# Altium schematic sheet УШЯИ.467444.130Э3_1-R1.SchDoc
size 420 x 297 mm; SheetNumber: 1; SheetTotal: 5
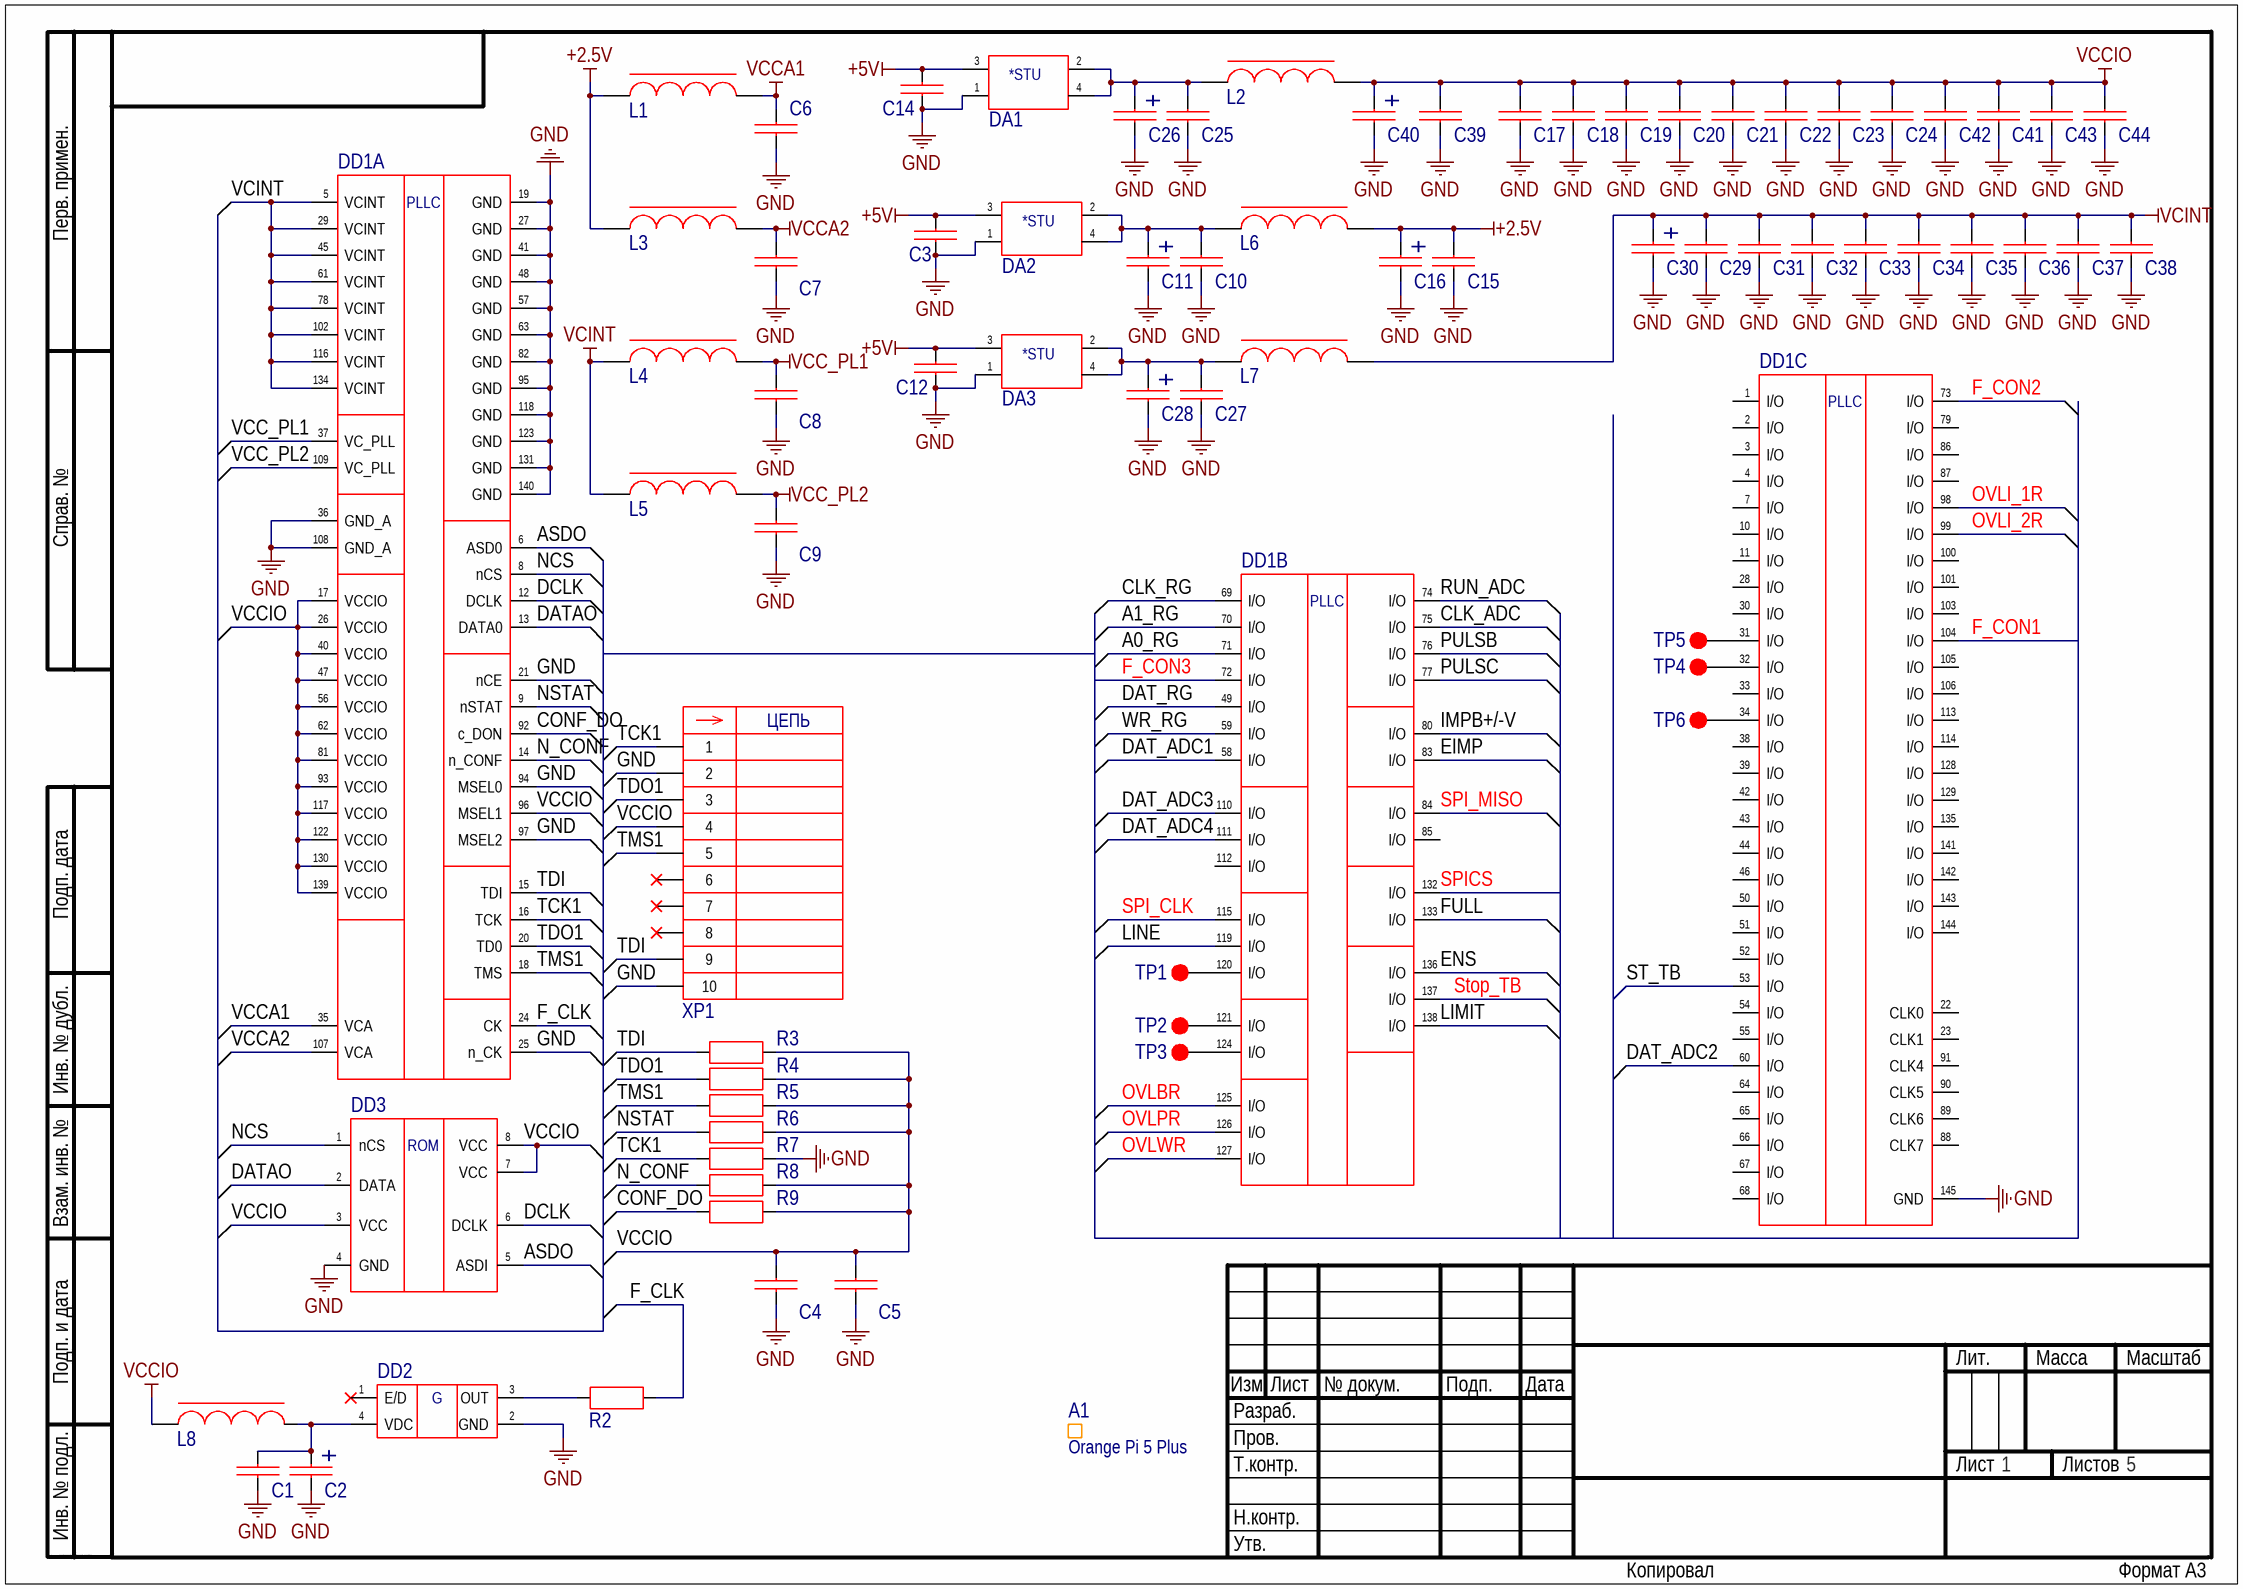
[diagram p0: УШЯИ.467444.130Э3_1-R1.SchDoc]

## Parts
A1  Orange Pi 5 Plus  [Orange_Pi_5_Plus]
C1  0,1 µF  [C_0805 [2012 Metric]]  (value not drawn)
C2  4,7 µF  [C+_1210 [3528-21 Metric]]  (value not drawn)
C3  0,1 µF  [C_0805 [2012 Metric]]  (value not drawn)
C4  1 µF  [C_0805 [2012 Metric]]  (value not drawn)
C5  1 µF  [C_0805 [2012 Metric]]  (value not drawn)
C6  0,1 µF  [C_0805 [2012 Metric]]  (value not drawn)
C7  0,1 µF  [C_0805 [2012 Metric]]  (value not drawn)
C8  0,1 µF  [C_0805 [2012 Metric]]  (value not drawn)
C9  0,1 µF  [C_0805 [2012 Metric]]  (value not drawn)
C10  0,1 µF  [C_0805 [2012 Metric]]  (value not drawn)
C11  4,7 µF  [C+_1210 [3528-21 Metric]]  (value not drawn)
C12  0,1 µF  [C_0805 [2012 Metric]]  (value not drawn)
C14  0,1 µF  [C_0805 [2012 Metric]]  (value not drawn)
C15  0,1 µF  [C_0805 [2012 Metric]]  (value not drawn)
C16  10 µF  [C+_1210 [3528-21 Metric]]  (value not drawn)
C17  0,1 µF  [C_0805 [2012 Metric]]  (value not drawn)
C18  0,1 µF  [C_0805 [2012 Metric]]  (value not drawn)
C19  0,1 µF  [C_0805 [2012 Metric]]  (value not drawn)
C20  0,1 µF  [C_0805 [2012 Metric]]  (value not drawn)
C21  0,1 µF  [C_0805 [2012 Metric]]  (value not drawn)
C22  0,1 µF  [C_0805 [2012 Metric]]  (value not drawn)
C23  0,1 µF  [C_0805 [2012 Metric]]  (value not drawn)
C24  0,1 µF  [C_0805 [2012 Metric]]  (value not drawn)
C25  0,1 µF  [C_0805 [2012 Metric]]  (value not drawn)
C26  4,7 µF  [C+_1210 [3528-21 Metric]]  (value not drawn)
C27  0,1 µF  [C_0805 [2012 Metric]]  (value not drawn)
C28  4,7 µF  [C+_1210 [3528-21 Metric]]  (value not drawn)
C29  0,1 µF  [C_0805 [2012 Metric]]  (value not drawn)
C30  4,7 µF  [C+_1210 [3528-21 Metric]]  (value not drawn)
C31  0,1 µF  [C_0805 [2012 Metric]]  (value not drawn)
C32  0,1 µF  [C_0805 [2012 Metric]]  (value not drawn)
C33  0,1 µF  [C_0805 [2012 Metric]]  (value not drawn)
C34  0,1 µF  [C_0805 [2012 Metric]]  (value not drawn)
C35  0,1 µF  [C_0805 [2012 Metric]]  (value not drawn)
C36  0,1 µF  [C_0805 [2012 Metric]]  (value not drawn)
C37  0,1 µF  [C_0805 [2012 Metric]]  (value not drawn)
C38  0,1 µF  [C_0805 [2012 Metric]]  (value not drawn)
C39  0,1 µF  [C_0805 [2012 Metric]]  (value not drawn)
C40  10 µF  [C+_1210 [3528-21 Metric]]  (value not drawn)
C41  0,1 µF  [C_0805 [2012 Metric]]  (value not drawn)
C42  0,1 µF  [C_0805 [2012 Metric]]  (value not drawn)
C43  0,1 µF  [C_0805 [2012 Metric]]  (value not drawn)
C44  0,1 µF  [C_0805 [2012 Metric]]  (value not drawn)
DA1  LD1117AS33TR  [SOT-223]  (value not drawn)
DA2  LD1117AS25TR  [SOT-223]  (value not drawn)
DA3  LD1117AS12TR  [SOT-223]  (value not drawn)
DD1  EP3C5E144I7  [EQFP-144[20x20]_0.5_22x22x1.6]  (value not drawn)  (parts A,B,C of 3)
DD2  O 20,0-JO32-B-3.3-1-T1-LF  [JO32]  (value not drawn)
DD3  EPCS4SI8N  [SOIC-8_1.27_5x4x1.75]  (value not drawn)
L1  0,22 μH  [IND_LQH31CN]  (value not drawn)
L2  (no value)  [IND_0805 [2012 Metric]]
L3  0,22 μH  [IND_LQH31CN]  (value not drawn)
L4  0,22 μH  [IND_LQH31CN]  (value not drawn)
L5  0,22 μH  [IND_LQH31CN]  (value not drawn)
L6  (no value)  [IND_0805 [2012 Metric]]
L7  (no value)  [IND_0805 [2012 Metric]]
L8  (no value)  [IND_0805 [2012 Metric]]
R2  51R  [R_0805 [2012 Metric]]  (value not drawn)
R3  1k  [R_0805 [2012 Metric]]  (value not drawn)
R4  10k  [R_0805 [2012 Metric]]  (value not drawn)
R5  1k  [R_0805 [2012 Metric]]  (value not drawn)
R6  10k  [R_0805 [2012 Metric]]  (value not drawn)
R7  1k  [R_0805 [2012 Metric]]  (value not drawn)
R8  10k  [R_0805 [2012 Metric]]  (value not drawn)
R9  10k  [R_0805 [2012 Metric]]  (value not drawn)
TP1  (no value)  [DSP_1.3]  (no BOM)
TP2  (no value)  [DSP_1.3]  (no BOM)
TP3  (no value)  [DSP_1.3]  (no BOM)
TP4  (no value)  [DSP_1.3]  (no BOM)
TP5  (no value)  [DSP_1.3]  (no BOM)
TP6  (no value)  [DSP_1.3]  (no BOM)
XP1  PLD-10  [PLD-10]  (value not drawn)

## Nets
+2.5V: C15.2 C16.+ L1.1 L3.1 L6.2
+5V: C3.2 C12.2 C14.2 DA1.3(VIN) DA2.3(VIN) DA3.3(VIN)
GND: C1.1 C2.- C3.1 C4.1 C5.1 C6.1 C7.1 C8.1 C9.1 C10.1 C11.- C12.1 C14.1 C15.1 C16.- C17.1 C18.1 C19.1 C20.1 C21.1 C22.1 C23.1 C24.1 C25.1 C26.- C27.1 C28.- C29.1 C30.- C31.1 C32.1 C33.1 C34.1 C35.1 C36.1 C37.1 C38.1 C39.1 C40.- C41.1 C42.1 C43.1 C44.1 DA1.1(ADJ/GND) DA2.1(ADJ/GND) DA3.1(ADJ/GND) DD1.19(GND) DD1.21(nCE) DD1.25(n_CK) DD1.27(GND) DD1.36(GND_A) DD1.41(GND) DD1.48(GND) DD1.57(GND) DD1.63(GND) DD1.82(GND) DD1.94(MSEL0) DD1.95(GND) DD1.97(MSEL2) DD1.108(GND_A) DD1.118(GND) DD1.123(GND) DD1.131(GND) DD1.140(GND) DD1.145(GND) DD2.2(GND) DD3.4(GND) R7.2 XP1.2 XP1.10
VCC_PL1: C8.2 DD1.37(VC_PLL) L4.2
VCC_PL2: C9.2 DD1.109(VC_PLL) L5.2
VCCA1: C6.2 DD1.35(VCA) L1.2
VCCA2: C7.2 DD1.107(VCA) L3.2
VCCIO: C4.2 C5.2 C17.2 C18.2 C19.2 C20.2 C21.2 C22.2 C23.2 C24.2 C39.2 C40.+ C41.2 C42.2 C43.2 C44.2 DD1.17(VCCIO) DD1.26(VCCIO) DD1.40(VCCIO) DD1.47(VCCIO) DD1.56(VCCIO) DD1.62(VCCIO) DD1.81(VCCIO) DD1.93(VCCIO) DD1.96(MSEL1) DD1.117(VCCIO) DD1.122(VCCIO) DD1.130(VCCIO) DD1.139(VCCIO) DD3.3(VCC) DD3.7(VCC) DD3.8(VCC) L2.2 L8.1 R3.2 R4.2 R5.2 R6.2 R8.2 R9.2 XP1.4
VCINT: C29.2 C30.+ C31.2 C32.2 C33.2 C34.2 C35.2 C36.2 C37.2 C38.2 DD1.5(VCINT) DD1.29(VCINT) DD1.45(VCINT) DD1.61(VCINT) DD1.78(VCINT) DD1.102(VCINT) DD1.116(VCINT) DD1.134(VCINT) L4.1 L5.1 L7.2
A0_RG: DD1.71(I/O)
A1_RG: DD1.70(I/O)
ASDO: DD1.6(ASD0) DD3.5(ASDI)
CLK_ADC: DD1.75(I/O)
CLK_RG: DD1.69(I/O)
CONF_DO: DD1.92(c_DON) R9.1
DAT_ADC1: DD1.58(I/O)
DAT_ADC2: DD1.60(I/O)
DAT_ADC3: DD1.110(I/O)
DAT_ADC4: DD1.111(I/O)
DAT_RG: DD1.49(I/O)
DATAO: DD1.13(DATA0) DD3.2(DATA)
DCLK: DD1.12(DCLK) DD3.6(DCLK)
EIMP: DD1.83(I/O)
ENS: DD1.136(I/O)
F_CLK: DD1.24(CK) R2.2
F_CON1: DD1.104(I/O)
F_CON2: DD1.73(I/O)
F_CON3: DD1.72(I/O)
FULL: DD1.133(I/O)
IMPB+/-V: DD1.80(I/O)
LIMIT: DD1.138(I/O)
LINE: DD1.119(I/O)
N_CONF: DD1.14(n_CONF) R8.1
NCS: DD1.8(nCS) DD3.1(nCS)
NSTAT: DD1.9(nSTAT) R6.1
OVLBR: DD1.125(I/O)
OVLI_1R: DD1.98(I/O)
OVLI_2R: DD1.99(I/O)
OVLPR: DD1.126(I/O)
OVLWR: DD1.127(I/O)
PULSB: DD1.76(I/O)
PULSC: DD1.77(I/O)
RUN_ADC: DD1.74(I/O)
SPI_CLK: DD1.115(I/O)
SPI_MISO: DD1.84(I/O)
SPICS: DD1.132(I/O)
ST_TB: DD1.53(I/O)
Stop_TB: DD1.137(I/O)
TCK1: DD1.16(TCK) R7.1 XP1.1
TDI: DD1.15(TDI) R3.1 XP1.9
TDO1: DD1.20(TD0) R4.1 XP1.3
TMS1: DD1.18(TMS) R5.1 XP1.5
WR_RG: DD1.59(I/O)
NetC1_2: C1.2 C2.+ DD2.4(VDC) L8.2
NetC10_2: C10.2 C11.+ DA2.2(VOUT) DA2.4(VOUT) L6.1
NetC25_2: C25.2 C26.+ DA1.2(VOUT) DA1.4(VOUT) L2.1
NetC27_2: C27.2 C28.+ DA3.2(VOUT) DA3.4(VOUT) L7.1
NetDD1_31: DD1.31(I/O) TP5.1
NetDD1_32: DD1.32(I/O) TP4.1
NetDD1_34: DD1.34(I/O) TP6.1
NetDD1_120: DD1.120(I/O) TP1.1
NetDD1_121: DD1.121(I/O) TP2.1
NetDD1_124: DD1.124(I/O) TP3.1
NetDD2_3: DD2.3(OUT) R2.1

Not connected (* = marked no-connect by the designer): DD1 1(I/O) 2(I/O) 3(I/O) 4(I/O) 7(I/O) 10(I/O) 11(I/O) 22(CLK0) 23(CLK1) 28(I/O) 30(I/O) 33(I/O) 38(I/O) 39(I/O) 42(I/O) 43(I/O) 44(I/O) 46(I/O) 50(I/O) 51(I/O) 52(I/O) 54(I/O) 55(I/O) 64(I/O) 65(I/O) 66(I/O) 67(I/O) 68(I/O) 79(I/O) 85(I/O) 86(I/O) 87(I/O) 88(CLK7) 89(CLK6) 90(CLK5) 91(CLK4) 100(I/O) 101(I/O) 103(I/O) 105(I/O) 106(I/O) 112(I/O) 113(I/O) 114(I/O) 128(I/O) 129(I/O) 135(I/O) 141(I/O) 142(I/O) 143(I/O) 144(I/O); DD2 1(E/D)*; XP1 6* 7* 8*

## Notes on the sheet
- Перв. примен.
- Справ. №
- Подп. дата
- Инв. № дубл.
- Взам. инв. №
- Подп. и дата
- Изм.
- Разраб.
- Лист
- № докум.
- Подп.
- Дата
- Лит.
- Масса
- Масштаб
- Пров.
- Т.контр.
- Листов
- Инв. № подл.
- Н.контр.
- Утв.
- ALTIUM GOSTBOM2.0 KEV
- Копировал
- Формат А3
- (in symbol Conn_7) ЦЕПЬ
- (in symbol IC_1) *STU
- (in symbol IC_8) *STU
- (in symbol IC_9) *STU
- (in symbol IC_12) ROM
- (in symbol IC_13, part A) PLLC
- (in symbol IC_13, part B) PLLC
- (in symbol IC_13, part C) PLLC
- (in symbol Other_16) G

## Library data of the parts
A1 = Other_15: 8GB Rockchip RK3588, HDMI 2.1, Gigabit LAN port, USB2.0/3.0, microSD card slot, USB Type-C; Component Name: Одноплатный компьютер Orange Pi 5 Plus 8GB; Other information: Идет с покупным устройством: твердотельный накопитель Kingspec SSD NE-128 2280; Крепёж: Винт В2.М3-6gx8.36.016 ГОСТ 17473-80 (4шт.), гайка М3-7Н.04.016 ГОСТ 5927-70 (4шт.), Шайба 3.65Г.016 ГОСТ 6402-70 (8шт.),  Шайба 3.04.013 ГОСТ 11371-78 (8шт.), Стойка PCHSN-10 (Ni) Connfly electronic (ChipDip 9000221060)(4шт.); ID: Other_15; Manufacturer: Orange Pi; Height: 29mm; Weight, kg: 0,115; Device: Orange Pi 5 Plus
C1 C3 C6-C10 C12 C14 C15 C17-C25 C27 C29 C31-C39 C41-C44 = Cap_60: Неполярный конденсатор; Manufacturer: Murata; ID: Cap_60; Component Name: Конденсатор GRM21BR71H104KA01L; Voltage: 50V; Tolerance: ±10%; Datasheet: https://www.murata.com/en-eu/products/productdetail?partno=GRM21BR71H104KA01%23; Capacitance: 0,1 µF; Case / Package: 0805 [2012 Metric]; Height: 1.4mm; Weight, kg: 0,000006
  C27 C29: ClassName: Class_VCINT
  C39: ClassName: Class_VCCIO
C2 C11 C26 C28 C30 = Cap_14: Полярный конденсатор; Manufacturer: KYOCERA AVX; ID: Cap_14; Component Name: Конденсатор TAJB475K020; Voltage: 20V / 10V; Tolerance: ±10%; Datasheet: https://datasheets.kyocera-avx.com/TAJ.pdf; Capacitance: 4,7 µF; Case / Package: 1210 [3528-21 Metric]; Height: 2mm; Weight, kg: 0,000016
  C11: ClassName: Class_+2.5V
  C26: ClassName: Class_VCCIO
  C28 C30: ClassName: Class_VCINT
C4 C5 = Cap_96: Неполярный конденсатор; Manufacturer: Murata; ID: Cap_96; Component Name: Конденсатор GRM21BR71H105KA01L; Voltage: 16V; Tolerance: ±10%; Catalogue: CHIPDIP 8046406206; Datasheet: https://static.chipdip.ru/lib/223/DOC011223313.pdf; Capacitance: 1 µF; Case / Package: 0805 [2012 Metric]; Height: 1.4mm; Weight, kg: 0,000006
C16 C40 = Cap_56: Полярный конденсатор; Manufacturer: KYOCERA AVX; ID: Cap_56; Component Name: Конденсатор TAJB106M020; Voltage: 20V / 10V; Tolerance: ±20%; Datasheet: https://datasheets.kyocera-avx.com/TAJ.pdf; Capacitance: 10 µF; Case / Package: 1210 [3528-21 Metric]; Height: 2mm; Weight, kg: 0,000016
  C16: ClassName: Class_+2.5V
  C40: ClassName: Class_VCCIO
DA1 = IC_1: IC, Fixed LDO Voltage Regulator, 5.3V to 10V, 1.15V Dropout, 3.3Vout, 1Aout; Manufacturer: STMicroelectronics; ID: IC_1; Component Name: Микросхема LD1117AS33TR; Catalogue: DIGI-KEY 497-1228-2-ND; Device: LD1117AS33TR; Datasheet: https://www.st.com/content/ccc/resource/technical/document/datasheet/a5/c3/3f/c9/2b/15/40/49/CD00002116.pdf/files/CD00002116.pdf/jcr:content/translations/en.CD00002116.pdf; Case / Package: SOT-223; Height: 1.9mm; Weight, kg: 0,0045; ClassName: Class_VCCIO
DA2 = IC_8: IC, Linear Voltage Regulator, 1 Output, 1V Dropout, 2.5Vout, 1Aout; Manufacturer: STMicroelectronics; ID: IC_8; Component Name: Микросхема LD1117AS25TR; Catalogue: DIGI-KEY 497-1227-1-ND; Device: LD1117AS25TR; Datasheet: https://www.st.com/content/ccc/resource/technical/document/datasheet/a5/c3/3f/c9/2b/15/40/49/CD00002116.pdf/files/CD00002116.pdf/jcr:content/translations/en.CD00002116.pdf; Case / Package: SOT-223; Height: 1.9mm; Weight, kg: 0,0045; ClassName: Class_+2.5V
DA3 = IC_9: IC, Fixed LDO Voltage Regulator, 1 Output, 1V Dropout, 1.2Vout, 1Aout; Manufacturer: STMicroelectronics; ID: IC_9; Component Name: Микросхема LD1117AS12TR; Catalogue: DIGI-KEY 497-6445-1-ND; Device: LD1117AS12TR; Datasheet: https://www.st.com/content/ccc/resource/technical/document/datasheet/a5/c3/3f/c9/2b/15/40/49/CD00002116.pdf/files/CD00002116.pdf/jcr:content/translations/en.CD00002116.pdf; Case / Package: SOT-223; Height: 1.9mm; Weight, kg: 0,0045; ClassName: Class_VCINT
DD1 = IC_13: IC, Cyclone III, Field Programmable Gate Array (FPGA), 	1.15V to 1.25V, 315 MHz, 94 I/O; Manufacturer: Intel; ID: IC_13; Component Name: Микросхема EP3C5E144I7; Catalogue: DIGI-KEY EP3C5E144I7-ND; Device: EP3C5E144I7; Datasheet: https://www.intel.com/content/dam/support/us/en/programmable/support-resources/bulk-container/pdfs/literature/hb/cfg/cyc-c51014.pdf; Case / Package: 144-EQFP (20x20); Height: 1.6mm; Weight, kg: 0,012
DD2 = Other_16: Crystals, Oscillators, 20 MHz; Manufacturer: Jauch Quartz GmbH; Component Name: Кварцевый генератор O 20,0-JO32-B-3.3-1-T1-LF; ID: Other_16; Datasheet: https://static.chipdip.ru/lib/464/DOC049464856.pdf; Height: 1.15mm; Weight, kg: 0,001; Device: O 20,0-JO32-B-3.3-1-T1-LF
DD3 = IC_12: IC, FPGA Configuration Memory, Flash, 4 Mbit, 40 MHz, JTAG, Serial; Manufacturer: Intel; ID: IC_12; Component Name: Микросхема EPCS4SI8N; Catalogue: FARNELL 1662262; Device: EPCS4SI8N; Datasheet: https://www.intel.com/content/dam/support/us/en/programmable/support-resources/bulk-container/pdfs/literature/hb/cfg/cyc-c51014.pdf; Case / Package: SOIC-8; Height: 1.75mm; Weight, kg: 0,0002
L1 L3-L5 = Ind_4: Manufacturer: Murata; ID: Ind_4; Component Name: Дроссель LQH31CNR22M03; Isat: 850mA; Resistance: 0.1 ohm; Tolerance: ±20%; Datasheet: https://www.murata.com/products/productdetail?partno=LQH31CNR22M03%23; Inductance: 0,22 μH; Height: 2mm; Weight, kg: 0,00003
L2 L6-L8 = Ind_5: Manufacturer: Vishay; ID: Ind_5; Component Name: Фильтр ферритовый ILBB0805ER601V; Isat: 200mA; Resistance: 300 mOhm; Tolerance: ±25%; Catalogue: DIGI-KEY 541-2297-1-ND; Datasheet: https://www.vishay.com/docs/34025/ilbb0805.pdf; Case / Package: 0805 [2012 Metric]; Height: 1.1mm; Weight, kg: 0,00006
  L2: ClassName: Class_VCCIO
  L6: ClassName: Class_+2.5V
  L7: ClassName: Class_VCINT
R2 = Res_12: ID: Res_12; Component Name: Резистор 0805-51 Ом ±5%; Tolerance: ±5%; Resistance: 51R; Case / Package: 0805 [2012 Metric]; Height: 0.7mm; Weight, kg: 0,000006
R3 R5 R7 = Res_11: ID: Res_11; Component Name: Резистор 0805-1 кОм ±5%; Tolerance: ±5%; Resistance: 1k; Case / Package: 0805 [2012 Metric]; Height: 0.7mm; Weight, kg: 0,000006
R4 R6 R8 R9 = Res_5: ID: Res_5; Component Name: Резистор 0805-10 кОм ±5%; Tolerance: ±5%; Resistance: 10k; Case / Package: 0805 [2012 Metric]; Height: 0.7mm; Weight, kg: 0,000006
TP1-TP6 = Pad_13: ID: Pad_13; Component Name: TP_DSP_1.3
XP1 = Conn_7: Male, 10 pins, 2 rows, Vertical; Manufacturer: Connfly electronic; ID: Conn_7; Component Name: Вилка PLD-10; Крепёж: Не нужно; Device: PLD-10; Datasheet: https://static.chipdip.ru/lib/977/DOC005977245.pdf; Height: 10.8mm; Weight, kg: 0,00052